# EAGLE design untitled (EAGLE 6.5.0)
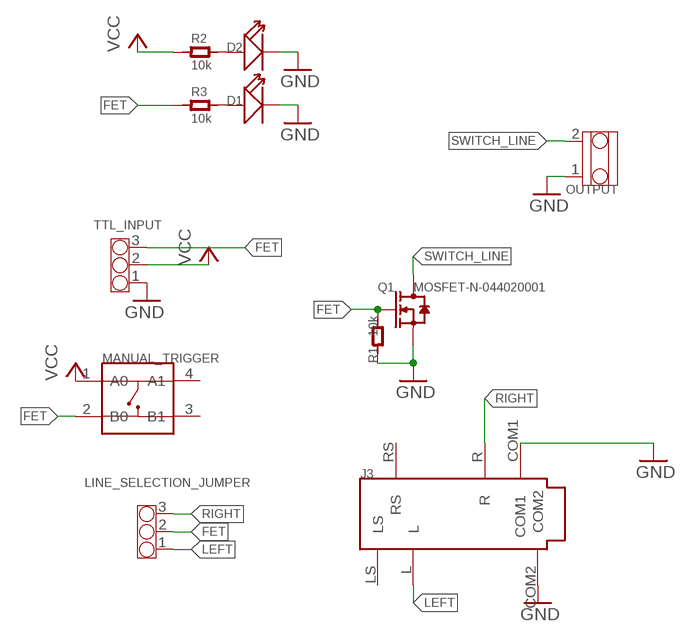
[diagram p0: schematic, sheet 1]

## Parts
D1  LED  [LED0603]
D2  LED  [LED0603]
J3  AUDIO-CONNECTOR-6P-SMD-3440030P1  [6P-SMD-3.5]
LINE_SELECTION_JUMPER  CONNECTOR-HEADER-3P-3460810P1  [1X3P-2.54-2.54-11.6-3.0-BLACK-MALE]
MANUAL_TRIGGER  manual data  BUTTON-4P-3100010P1  [4P-SMD-6.0X6.0X5.0H]
OUTPUT  SCREW-TERMINAL-2P-3470070P1  [2P-3.5]
Q1  MOSFET-N-044020001  [SOT23]
R1  10k  R-0603  [R0603]
R2  10k  R-0603  [R0603]
R3  10k  R-0603  [R0603]
TTL_INPUT  CONNECTOR-HEADER-3P-3460810P1  [1X3P-2.54-2.54-11.6-3.0-BLACK-MALE]

## Nets
FET: LINE_SELECTION_JUMPER.2 MANUAL_TRIGGER.2(B0) Q1.1(G) R1.2 R3.1 TTL_INPUT.3
GND: D1.- D2.- J3.COM1 J3.COM2 OUTPUT.1 Q1.2(S) R1.1 TTL_INPUT.1
LEFT: J3.L LINE_SELECTION_JUMPER.1
N$1: D1.+ R3.2
N$2: D2.+ R2.2
RIGHT: J3.R LINE_SELECTION_JUMPER.3
SWITCH_LINE: OUTPUT.2 Q1.3(D)
VCC: MANUAL_TRIGGER.1(A0) R2.1 TTL_INPUT.2
Unconnected: J3.LS J3.RS MANUAL_TRIGGER.3(B1) MANUAL_TRIGGER.4(A1)

## Library data of the parts
D1 D2 = OPL Eagle Library:LED*: LED
J3 = OPL Eagle Library:AUDIO-CONNECTOR-6P-SMD: When you use the footprint ,place notice 46 (layer)milling ,there is some important information.
LINE_SELECTION_JUMPER TTL_INPUT = OPL Eagle Library:CONNECTOR-HEADER-3P
MANUAL_TRIGGER = OPL Eagle Library:BUTTON-4P
OUTPUT = OPL Eagle Library:SCREW-TERMINAL-2P
Q1 = OPL Eagle Library:MOSFET-N: CJ2302：SMD MOSFET N-CH 20V-2.1A
R1-R3 = OPL Eagle Library:R*

## Board
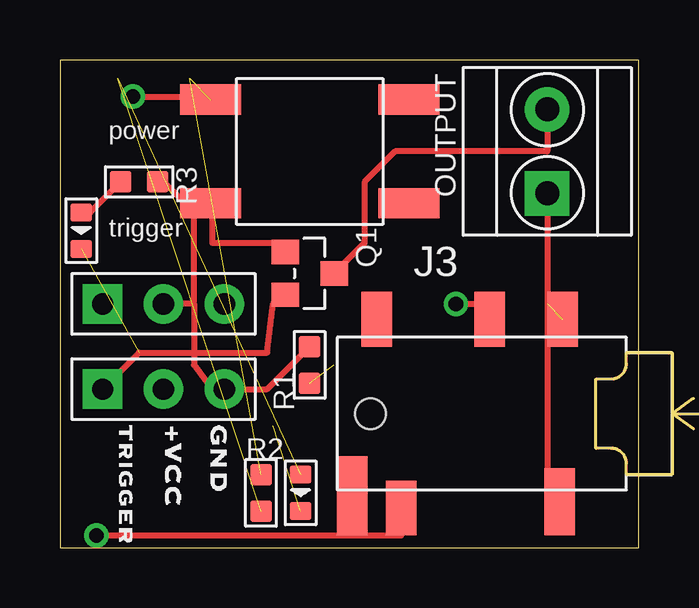
[diagram p1: board, top side]
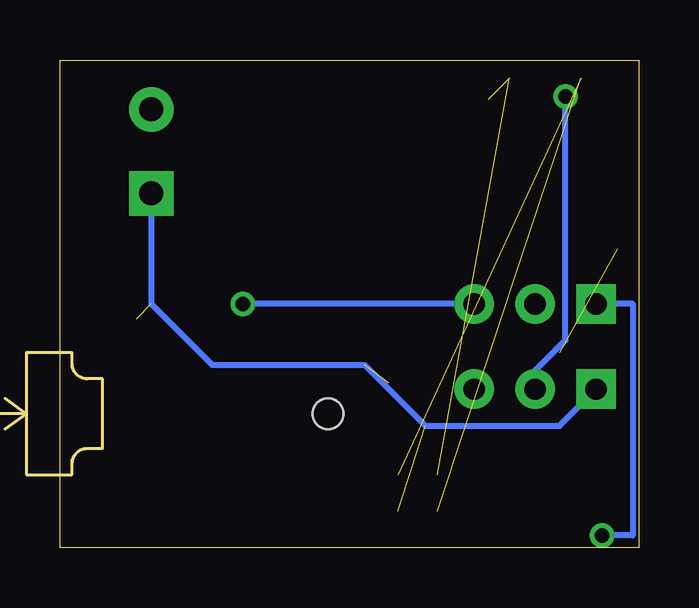
[diagram p2: board, bottom side, seen from below]

Size 24.13 x 20.32 mm. Coordinates in mm from the lower left corner, seen from the top.
Outline: 0,0 24.13,0 24.13,20.32 0,20.32 0,0
Copper layers (1*16): Top 0.035mm / dielectric 1.5mm / Bottom 0.035mm
Design rules "default": minimum track width 10mil, minimum drill 24mil, track to track 8mil, track to pad 8mil, pad to pad 8mil, via to via 8mil, smd to smd 8mil, copper to edge 40mil, drill to drill 8mil, minimum pad ring 10mil, minimum via ring 8mil, stop-mask expansion 4mil, vias tented up to drill 0mil, thermal gap 10mil

### Footprints (pad centres in the part's own frame; a part is rotated, then mirrored left to right if it is on the bottom)
LED0603 = smd 0.762 x 0.889: + -0.762,0; - 0.762,0
6P-SMD-3.5 = smd 1.27 x 2.286: COM1 2.413,3.937; L -4.318,-3.937; R -0.635,3.937; RS -5.334,3.937 | smd 1.27 x 2.794: COM2 2.286,-3.683 | smd 1.27 x 3.302: LS -6.35,-3.429 | hole 1.27: -5.588,0
1X3P-2.54-2.54-11.6-3.0-BLACK-MALE = drill 0.889 pad 1.651 square: 1 0,2.54 | drill 0.889 pad 1.651: 2 0,0; 3 0,-2.54
4P-SMD-6.0X6.0X5.0H = smd 2.54 x 1.27: 1 -4.129,2.159; 2 -4.129,-2.159; 3 4.129,-2.159; 4 4.129,2.159
2P-3.5 = drill 1 pad 1.85 square: 1 -1.75,0 | drill 1 pad 1.85: 2 1.75,0
SOT23 = smd 1.016 x 1.143: 1 -0.889,-1.016; 2 0.889,-1.016; 3 0,1.016
R0603 = smd 0.889 x 0.889: 1 -0.762,0; 2 0.762,0

### Placement (x,y rotation side)
D1  0.89,13.21 270 top
D2  10.03,2.29 270 top
J3  18.54,5.59 0 top
LINE_SELECTION_JUMPER  4.32,10.16 90 top
MANUAL_TRIGGER  10.41,16.51 0 top
OUTPUT  20.32,16.51 90 top
Q1  10.41,11.43 270 top
R1  10.41,7.62 90 top
R2  8.38,2.29 270 top
R3  3.3,15.24 180 top
TTL_INPUT  4.32,6.6 90 top

### Tracks (layer width: path | path; a pad name or v marks a point on that pad's centre or on a via)
FET
  Top 0.254: 5.59,13.97 4.06,15.49 R3.1 | Q1.1 8.89,12.7 6.35,12.7 6.35,13.97 MANUAL_TRIGGER.2 5.59,13.97 | 5.59,10.16 5.59,7.62 6.35,6.6 TTL_INPUT.3 8.64,6.6 R1.2 | 5.59,10.16 5.59,13.97 | 5.59,10.16 LINE_SELECTION_JUMPER.2
GND  (4 unrouted)
  Top 0.254: TTL_INPUT.1 3.3,8.13 8.64,8.13 8.89,10.16 Q1.2 | OUTPUT.1 20.32,2.54 J3.COM2
  Bottom 0.254: TTL_INPUT.1 3.3,5.08 8.89,5.08 11.43,7.62 17.78,7.62 20.32,10.16 OUTPUT.1
LEFT  (via drill 0.61)
  Top 0.254: v1.52,0.51 14.22,0.51 J3.L
  Bottom 0.254: v1.52,0.51 0.25,0.51 0.25,10.16 LINE_SELECTION_JUMPER.1
N$1
  Top 0.254: R3.2 1.27,13.97 D1.+
N$2  (2 unrouted)
RIGHT  (via drill 0.61)
  Top 0.254: v16.51,10.16 17.78,10.16 J3.R
  Bottom 0.254: LINE_SELECTION_JUMPER.3 v16.51,10.16
SWITCH_LINE
  Top 0.254: Q1.3 12.7,12.7 12.7,15.24 13.97,16.51 20.32,16.51 OUTPUT.2
VCC  (via drill 0.61)  (2 unrouted)
  Top 0.254: v3.05,18.8 6.35,18.8 MANUAL_TRIGGER.1
  Bottom 0.254: v3.05,18.8 3.05,8.64 4.32,7.37 TTL_INPUT.2

### Text on the board
tPlace: power | trigger